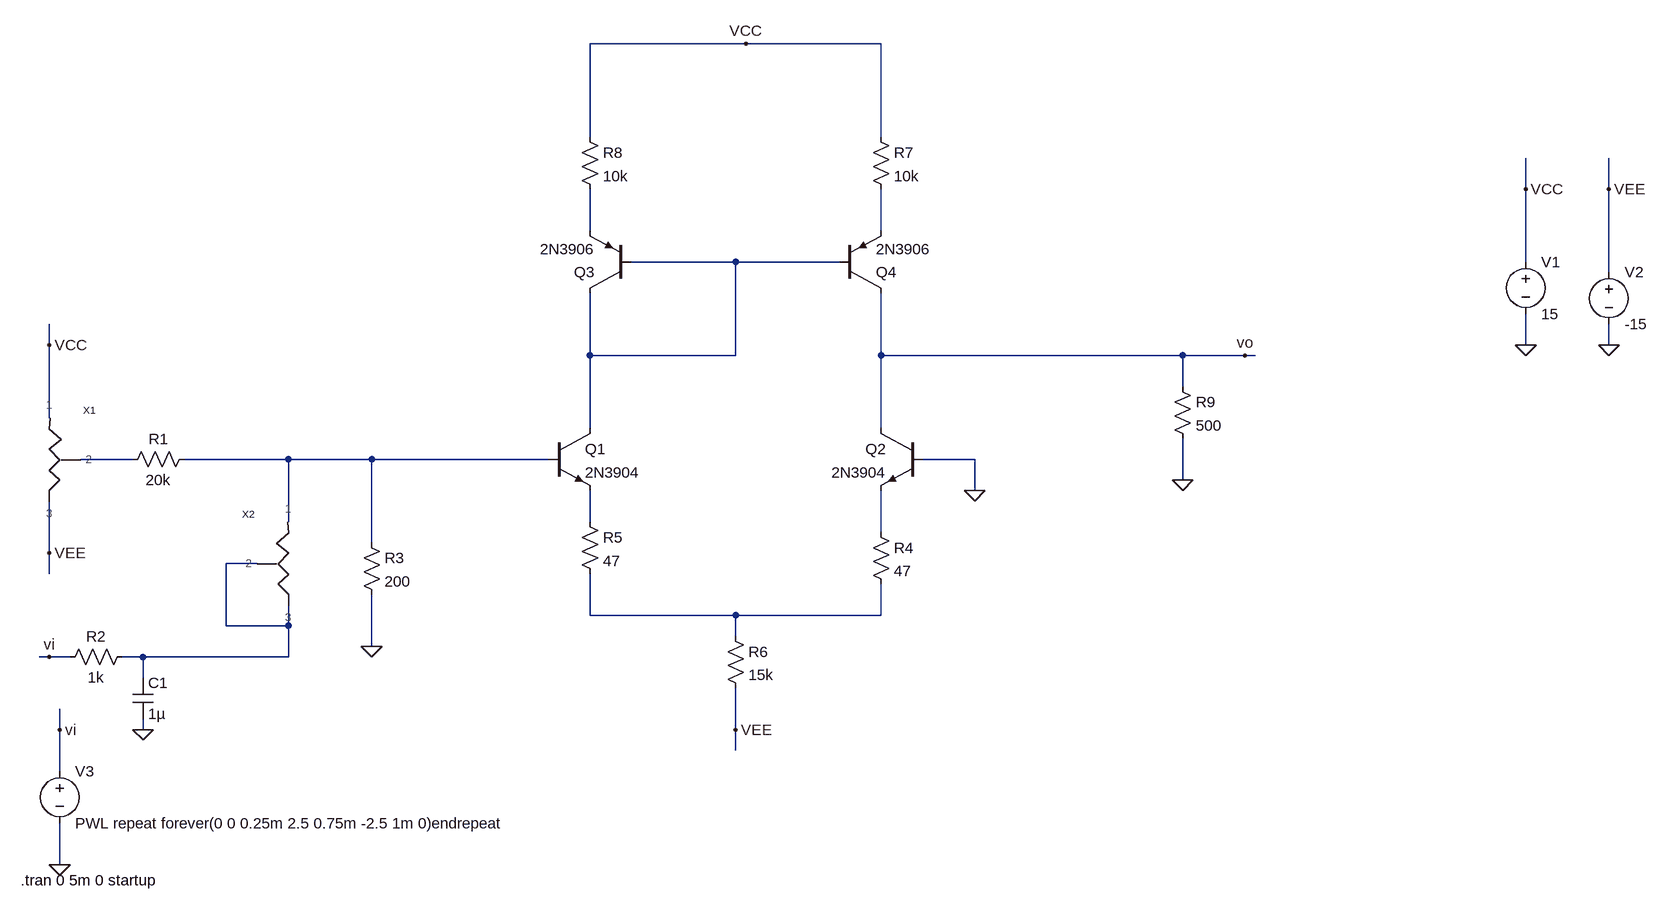
[diagram p0: schematic 2_22.asc]
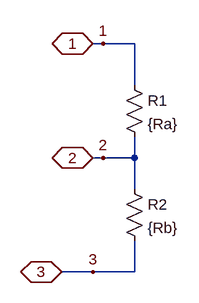
[diagram p1: sub-circuit dian_wei_qi.asc]
2_22.asc, the LTspice schematic file:
Version 4
SHEET 1 2500 808
WIRE 1104 -496 864 -496
WIRE 1312 -496 1104 -496
WIRE 864 -352 864 -496
WIRE 1312 -352 1312 -496
WIRE 2304 -272 2304 -320
WIRE 2432 -272 2432 -320
WIRE 864 -208 864 -272
WIRE 1312 -208 1312 -272
WIRE 1088 -160 928 -160
WIRE 1248 -160 1088 -160
WIRE 2304 -160 2304 -272
WIRE 2432 -144 2432 -272
WIRE 32 -32 32 -64
WIRE 2304 -32 2304 -80
WIRE 2432 -32 2432 -64
WIRE 864 -16 864 -112
WIRE 1088 -16 1088 -160
WIRE 1088 -16 864 -16
WIRE 1312 -16 1312 -112
WIRE 1776 -16 1312 -16
WIRE 1872 -16 1776 -16
WIRE 1888 -16 1872 -16
WIRE 1776 32 1776 -16
WIRE 32 80 32 -32
WIRE 864 96 864 -16
WIRE 1312 96 1312 -16
WIRE 160 144 80 144
WIRE 400 144 240 144
WIRE 528 144 400 144
WIRE 800 144 528 144
WIRE 1456 144 1376 144
WIRE 1776 176 1776 112
WIRE 1456 192 1456 144
WIRE 400 240 400 144
WIRE 864 240 864 192
WIRE 1312 256 1312 192
WIRE 528 272 528 144
WIRE 32 288 32 208
WIRE 352 304 304 304
WIRE 32 320 32 288
WIRE 864 384 864 320
WIRE 1088 384 864 384
WIRE 1312 384 1312 336
WIRE 1312 384 1088 384
WIRE 304 400 304 304
WIRE 400 400 400 368
WIRE 400 400 304 400
WIRE 1088 416 1088 384
WIRE 528 432 528 352
WIRE 32 448 16 448
WIRE 64 448 32 448
WIRE 176 448 144 448
WIRE 400 448 400 400
WIRE 400 448 176 448
WIRE 176 480 176 448
WIRE 48 560 48 528
WIRE 176 560 176 544
WIRE 1088 560 1088 496
WIRE 1088 592 1088 560
WIRE 48 624 48 560
WIRE 48 768 48 704
FLAG 1456 192 0
FLAG 528 432 0
FLAG 32 -32 VCC
FLAG 1104 -496 VCC
FLAG 1088 560 VEE
FLAG 32 288 VEE
FLAG 1872 -16 vo
FLAG 32 448 vi
FLAG 2304 -32 0
FLAG 2432 -32 0
FLAG 2304 -272 VCC
FLAG 2432 -272 VEE
FLAG 48 768 0
FLAG 48 560 vi
FLAG 176 560 0
FLAG 1776 176 0
SYMBOL dian_wei_qi 16 144 R0
SYMATTR InstName X1
SYMATTR SpiceLine Ra=2.5k,Rb=2k
SYMBOL res 256 128 R90
WINDOW 0 0 56 VBottom 2
WINDOW 3 32 56 VTop 2
SYMATTR InstName R1
SYMATTR Value 20k
SYMBOL dian_wei_qi 416 304 M0
SYMATTR InstName X2
SYMATTR SpiceLine Ra=1k,Rb=3500k
SYMBOL res 512 256 R0
SYMATTR InstName R3
SYMATTR Value 200
SYMBOL npn 800 96 R0
SYMATTR InstName Q1
SYMATTR Value 2N3904
SYMBOL npn 1376 96 M0
SYMATTR InstName Q2
SYMATTR Value 2N3904
SYMBOL res 1296 240 R0
SYMATTR InstName R4
SYMATTR Value 47
SYMBOL res 848 224 R0
SYMATTR InstName R5
SYMATTR Value 47
SYMBOL res 1072 400 R0
SYMATTR InstName R6
SYMATTR Value 15k
SYMBOL pnp 928 -112 R180
SYMATTR InstName Q3
SYMATTR Value 2N3906
SYMBOL pnp 1248 -112 M180
SYMATTR InstName Q4
SYMATTR Value 2N3906
SYMBOL res 1296 -368 R0
SYMATTR InstName R7
SYMATTR Value 10k
SYMBOL res 848 -368 R0
SYMATTR InstName R8
SYMATTR Value 10k
SYMBOL voltage 2304 -176 R0
WINDOW 123 0 0 Left 0
WINDOW 39 0 0 Left 0
SYMATTR InstName V1
SYMATTR Value 15
SYMBOL voltage 2432 -160 R0
WINDOW 123 0 0 Left 0
WINDOW 39 0 0 Left 0
SYMATTR InstName V2
SYMATTR Value -15
SYMBOL voltage 48 608 R0
SYMATTR InstName V3
SYMATTR Value PWL repeat forever(0 0 0.25m 2.5 0.75m -2.5 1m 0)endrepeat
SYMBOL cap 160 480 R0
SYMATTR InstName C1
SYMATTR Value 1µ
SYMBOL res 160 432 R90
WINDOW 0 0 56 VBottom 2
WINDOW 3 32 56 VTop 2
SYMATTR InstName R2
SYMATTR Value 1k
SYMBOL res 1760 16 R0
SYMATTR InstName R9
SYMATTR Value 500
TEXT -12 792 Left 2 !.tran 0 5m 0 startup

dian_wei_qi.asc, the sub-circuit schematic file:
Version 4
SHEET 1 880 680
WIRE 144 -32 128 -32
WIRE 192 -32 144 -32
WIRE 192 32 192 -32
WIRE 144 144 128 144
WIRE 192 144 192 112
WIRE 192 144 144 144
WIRE 192 192 192 144
WIRE 128 320 80 320
WIRE 192 320 192 272
WIRE 192 320 128 320
FLAG 144 -32 1
FLAG 144 144 2
FLAG 128 320 3
FLAG 128 -32 1
IOPIN 128 -32 BiDir
FLAG 128 144 2
IOPIN 128 144 BiDir
FLAG 80 320 3
IOPIN 80 320 BiDir
SYMBOL res 176 16 R0
SYMATTR InstName R1
SYMATTR Value {Ra}
SYMBOL res 176 176 R0
SYMATTR InstName R2
SYMATTR Value {Rb}

The netlist it stands for:
* 2_22.asc
XX1 VCC N004 VEE dian_wei_qi params: Ra=2.5k,Rb=2k
R1 N005 N004 20k
XX2 N005 N008 N008 dian_wei_qi params: Ra=1k,Rb=3500k
R3 N005 0 200
Q1 N003 N005 N006 0 2N3904
Q2 vo 0 N007 0 2N3904
R4 N007 N009 47
R5 N006 N009 47
R6 N009 VEE 15k
Q3 N003 N003 N001 0 2N3906
Q4 vo N003 N002 0 2N3906
R7 VCC N002 10k
R8 VCC N001 10k
V1 VCC 0 15
V2 VEE 0 -15
V3 vi 0 PWL repeat forever(0 0 0.25m 2.5 0.75m -2.5 1m 0)endrepeat
C1 N008 0 1µ
R2 N008 vi 1k
R9 vo 0 500

* block symbol definitions
.subckt dian_wei_qi 1 2 3
R1 1 2 {Ra}
R2 2 3 {Rb}
.ends dian_wei_qi

.model NPN NPN
.model PNP PNP
.lib standard.bjt
.tran 0 5m 0 startup
.backanno
.end

* Results of the author's LTspice run, read from the files saved beside the schematic
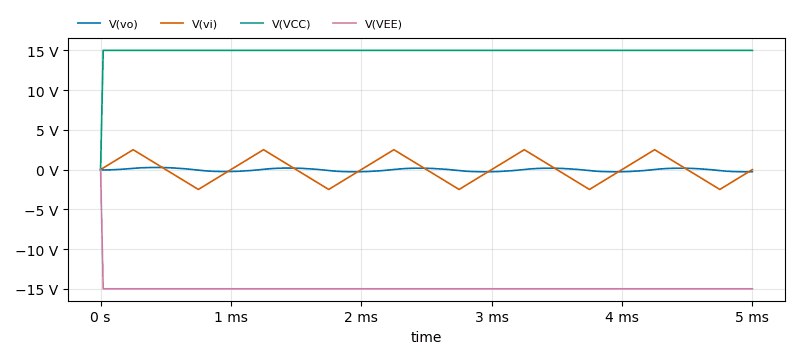
[diagram p2: Transient Analysis of 2_22.asc, plotted from the saved traces]
* Transient Analysis, 1 run:
*   V(vo): min -279.5 mV, max 267.7 mV, average -31.62 mV, rms 175.4 mV, last -270.2 mV
*   V(vi): min -2.5 V, max 2.5 V, average 0 V, rms 1.454 V, last 0 V
*   V(VCC): min 0 V, max 15 V, average 14.97 V, rms 14.98 V, last 15 V
*   V(VEE): min -15 V, max 0 V, average -14.97 V, rms 14.98 V, last -15 V